# Altium schematic sheet [06] - SPI I2C devices.SchDoc: DWM1003
size A4; DocumentNumber: 6; Revision: v2; SheetNumber: 6; SheetTotal: 7; SheetFunction: 10DoF IMU
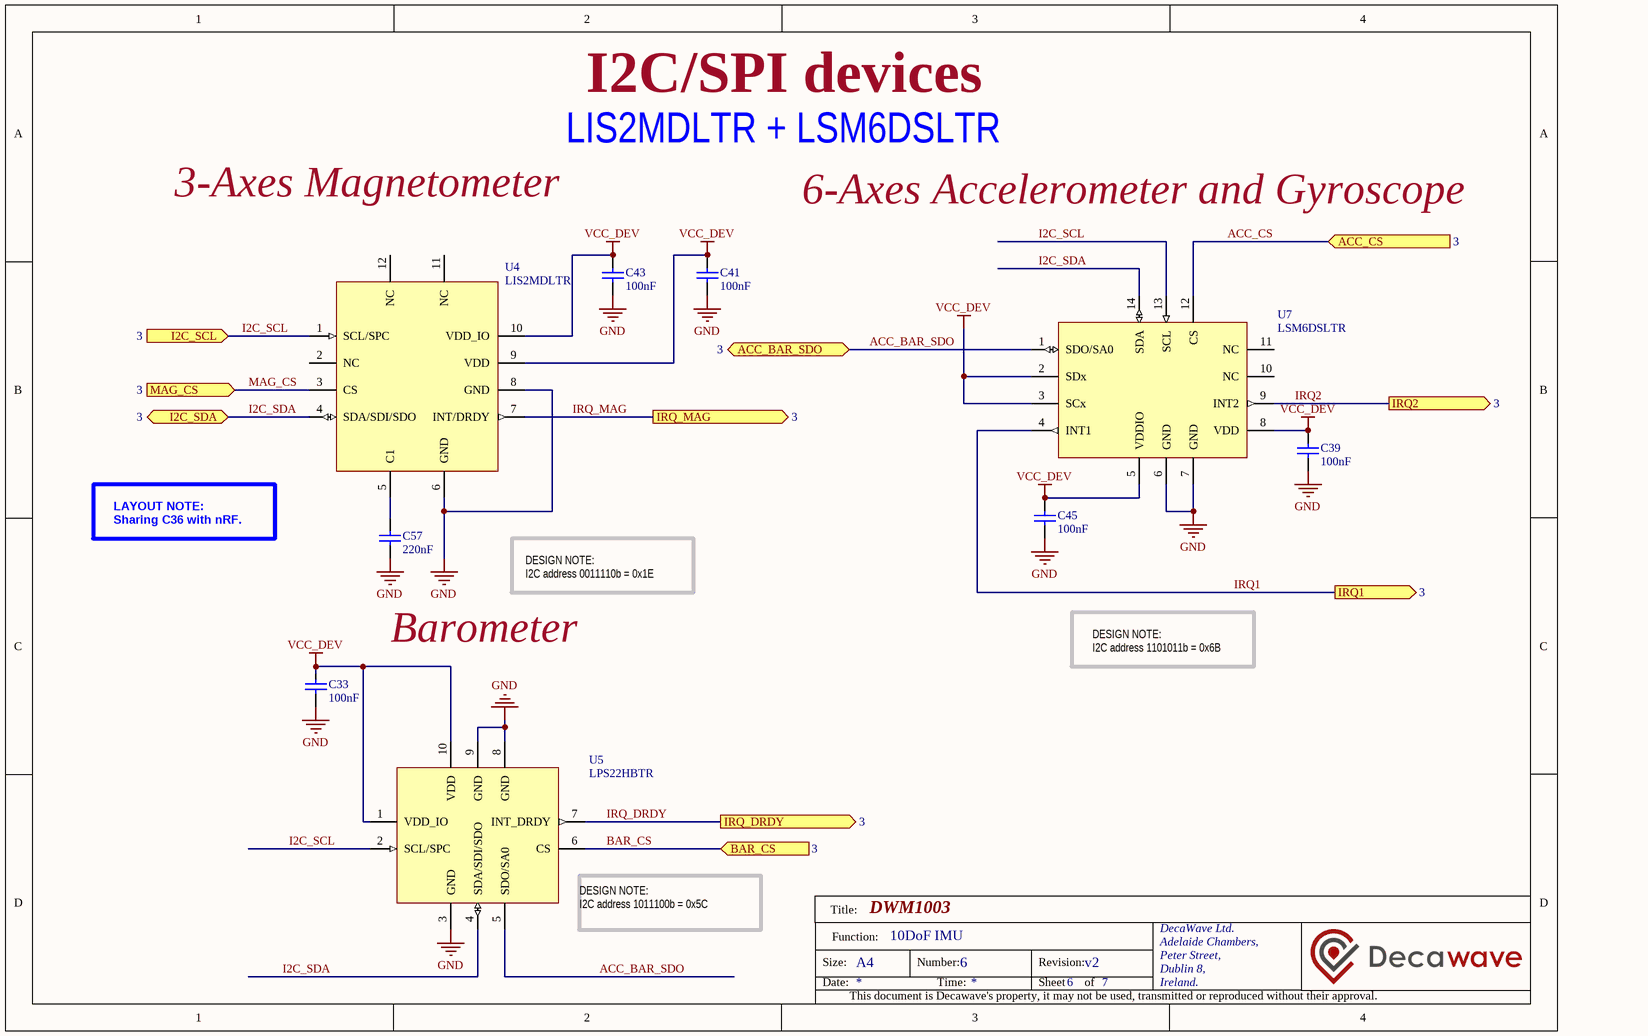
[diagram p0: [06] - SPI I2C devices.SchDoc]

## Parts
C33  100nF  [C0201]
C39  100nF  [C0201]
C41  100nF  [C0201]
C43  100nF  [C0201]
C45  100nF  [C0201]
C57  220nF  [C0201]
U4  LIS2MDLTR  [IC_LGA-12]
U5  LPS22HBTR  [HLGA-10L]
U7  LSM6DSLTR  [IC_LGA-14]

## Ports
ACC_BAR_SDO (bidir, see 3), ACC_CS (in, see 3), BAR_CS (in, see 3), I2C_SCL (in, see 3), I2C_SDA (bidir, see 3), IRQ1 (out, see 3), IRQ2 (out, see 3), IRQ_DRDY (out, see 3), IRQ_MAG (out, see 3), MAG_CS (in, see 3)

## Nets
GND: C33.1 C39.1 C41.1 C43.1 C45.1 C57.1 U4.6(GND) U4.8(GND) U5.3(GND) U5.8(GND) U5.9(GND) U7.6(GND) U7.7(GND)
VCC_DEV: C33.2 C39.2 C41.2 C43.2 C45.2 U4.9(VDD) U4.10(VDD_IO) U5.1(VDD_IO) U5.10(VDD) U7.2(SDx) U7.3(SCx) U7.5(VDDIO) U7.8(VDD)
ACC_BAR_SDO: U5.5(SDO/SA0) U7.1(SDO/SA0) ; port ACC_BAR_SDO
ACC_CS: U7.12(CS) ; port ACC_CS
BAR_CS: U5.6(CS) ; port BAR_CS
I2C_SCL: U4.1(SCL/SPC) U5.2(SCL/SPC) U7.13(SCL) ; port I2C_SCL
I2C_SDA: U4.4(SDA/SDI/SDO) U5.4(SDA/SDI/SDO) U7.14(SDA) ; port I2C_SDA
IRQ1: U7.4(INT1) ; port IRQ1
IRQ2: U7.9(INT2) ; port IRQ2
IRQ_DRDY: U5.7(INT_DRDY) ; port IRQ_DRDY
IRQ_MAG: U4.7(INT/DRDY) ; port IRQ_MAG
MAG_CS: U4.3(CS) ; port MAG_CS
NetC57_2: C57.2 U4.5(C1)

Not connected (* = marked no-connect by the designer): U4 2(NC) 11(NC) 12(NC); U7 10(NC) 11(NC)

## Notes on the sheet
- I2C/SPI devices
- LIS2MDLTR + LSM6DSLTR
- 3-Axes Magnetometer
- 6-Axes Accelerometer and Gyroscope
- (near U4) LAYOUT NOTE:
  Sharing C36 with nRF.
- Barometer
- DESIGN NOTE:
  I2C address 0011110b = 0x1E
- DESIGN NOTE:
  I2C address 1101011b = 0x6B
- (near U5) DESIGN NOTE:
  I2C address 1011100b = 0x5C
- Title:
- Size:
- Date:
- Function:
- A4
- Number:
- Time:
- Revision:
- Sheet
- of
- DecaWave Ltd.
- Adelaide Chambers,
- Peter Street,
- Dublin 8,
- Ireland.
- This document is Decawave's property, it may not be used, transmitted or reproduced without their approval.

## Library data of the parts
C33 C39 C41 C43 C45 = GRM033C81E104ME14D: CAP CER 0.1UF 25V X6S 0201; Manufacturer: Murata Electronics North America; Manufacturer Part Number: GRM033C81E104ME14D
C57 = GRM033C81E104ME14D: CAP CER 220NF 25V X6S 0201; Manufacturer: Murata Electronics North America; Manufacturer Part Number: GRM033R61A224KE90D
U4 = LIS2MDL: Manufacturer: STmicroelectronics; Manufacturer Part Number: LIS2MDLTR
U5 = LPS22HB: Manufacturer: STmicroelectronics; Manufacturer Part Number: LPS22HBTR
U7 = LSM6DSL: Manufacturer: STmicroelectronics; Manufacturer Part Number: LSM6DSLTR